# EAGLE design MC-test (EAGLE 8.6.0)
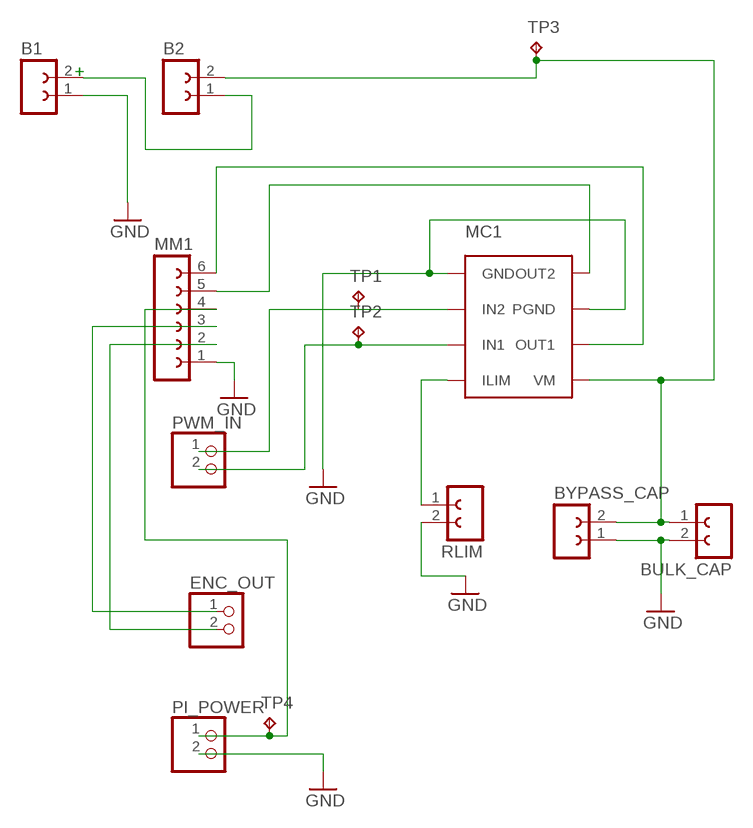
[diagram p0: schematic, sheet 1]

## Parts
B1  FH_02X01  [FH_02X01]
B2  FH_02X01  [FH_02X01]
BULK_CAP  FH_02X01  [FH_02X01]
BYPASS_CAP  FH_02X01  [FH_02X01]
ENC_OUT  PINHD-1X2  [1X02]
MC1  DRV8871  [SO-8_POWERPAD]
MM1  FE06-1  [FE06]
PI_POWER  PINHD-1X2  [1X02]
PWM_IN  PINHD-1X2  [1X02]
RLIM  FH_02X01  [FH_02X01]
TP1  TPTP15SQ  [TP15SQ]
TP2  TPTP15SQ  [TP15SQ]
TP3  TPTP15SQ  [TP15SQ]
TP4  TPTP15SQ  [TP15SQ]

## Nets
3.3V: MM1.4 PI_POWER.1 TP4.TP
GND: B1.1 BULK_CAP.2 BYPASS_CAP.1 MC1.1(GND) MC1.7(PGND) MM1.1 PI_POWER.2 RLIM.2
M+: MC1.8(OUT2) MM1.5
N$1: ENC_OUT.1 MM1.3
N$3: MC1.6(OUT1) MM1.6
N$4: B1.2 B2.1
N$5: B2.2 BULK_CAP.1 BYPASS_CAP.2 MC1.5(VM) TP3.TP
N$6: MC1.4(ILIM) RLIM.1
N$7: ENC_OUT.2 MM1.2
N$8: MC1.3(IN1) PWM_IN.2 TP2.TP
N$9: MC1.2(IN2) PWM_IN.1 TP1.TP

## Notes on the sheet
- +

## Library data of the parts
B1 B2 BULK_CAP BYPASS_CAP = Parts:FH_02X01: Female Header: 2 pins, 1 row, not angled. Identical to con-lsta (but in different sizes).
ENC_OUT PI_POWER PWM_IN = pinhead:PINHD-1X2: PIN HEADER
MC1 = Parts:DRV8871
MM1 = con-lsta:FE06-1: FEMALE HEADER; OC_FARNELL: unknown; OC_NEWARK: unknown
RLIM = Parts:FH_02X01: Female Header: 2 pins, 1 row, not angled. Identical to con-lsta (but in different sizes).; SPICEPREFIX: B
TP1-TP4 = testpad:TP: Test pad

## Board
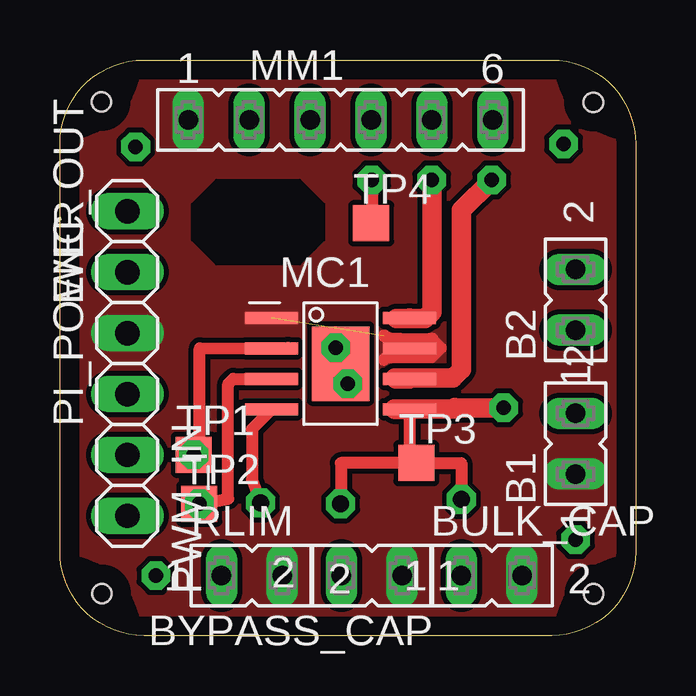
[diagram p1: board, top side]
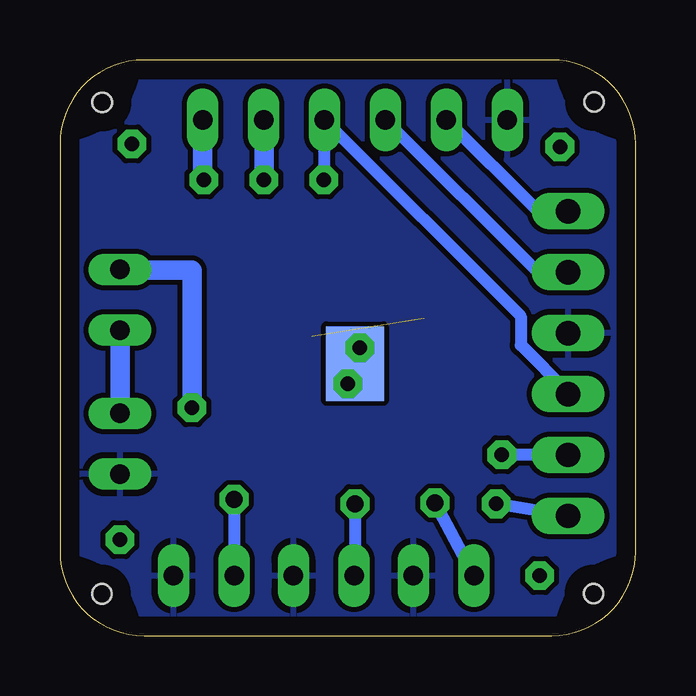
[diagram p2: board, bottom side, seen from below]

Size 24 x 24 mm. Coordinates in mm from the lower left corner, seen from the top.
Outline: 24,20.5 24,3.5 arc-90 20.5,0 3.5,0 arc-90 0,3.5 0,20.5 arc-90 3.5,24 20.5,24 arc-90 24,20.5
Copper layers (1*16): Top 0.035mm / dielectric 1.5mm / Bottom 0.035mm
Design rules "default *": minimum track width 10mil, minimum drill 0.35mm, track to track 8mil, track to pad 8mil, pad to pad 8mil, via to via 8mil, smd to smd 8mil, copper to edge 0.8mm, drill to drill 1mm, minimum pad ring 10mil, minimum via ring 8mil, stop-mask expansion 4mil, vias tented up to drill 0mil, thermal gap 10mil
Holes 0.8 mm at 1.73,22.25 22.24,22.24 22.25,1.74 1.75,1.76

### Footprints (pad centres in the part's own frame; a part is rotated, then mirrored left to right if it is on the bottom)
FH_02X01 = drill 0.813 long: 1 -1.27,0; 2 1.27,0
1X02 = drill 1.016 long: 1 -1.27,0; 2 1.27,0
SO-8_POWERPAD = smd 0.5 x 2.2: 1 -1.905,-2.875; 2 -0.635,-2.875; 3 0.635,-2.875; 4 1.905,-2.875; 5 1.905,2.875; 6 0.635,2.875; 7 -0.635,2.875; 8 -1.905,2.875 | smd 3.1 x 2.4 bottom: POWERPAD_BOTTOM 0,0 | smd 3.1 x 2.4: POWERPAD_TOP 0,0
FE06 = drill 0.813 long: 1 -6.35,0; 2 -3.81,0; 3 -1.27,0; 4 1.27,0; 5 3.81,0; 6 6.35,0
TP15SQ = smd 1.5 x 1.5: TP 0,0

### Placement (x,y rotation side)
B1  21.5,8 90 top
B2  21.5,14 90 top
BULK_CAP  18,2.5 0 top
BYPASS_CAP  13,2.5 180 top
ENC_OUT  2.81,16.42 90 top
MC1  11.7,11.34 270 top
MM1  11.7,21.5 0 top
PI_POWER  2.81,11.34 90 top
PWM_IN  2.81,6.26 270 top
RLIM  8,2.5 0 top
TP1  5.58,7.54 0 top
TP2  5.81,5.5 0 top
TP3  14.86,7.19 0 top
TP4  12.97,17.19 0 top

### Tracks (layer width: path | path; a pad name or v marks a point on that pad's centre or on a via)
3.3V  (via drill 0.6 pad 1.2)
  Top 0.508: v13,19 13,17.22 TP4.TP
  Bottom 0.508: v13,19 13,21.47 MM1.4 4.79,13.32 4.79,12.11 2.81,10.12 PI_POWER.1
GND  (1 unrouted)
  Top 0.508: 14.19,12.37 MC1.7 14.78,11.78 13.78,11.78 13.61,11.61 | 14.19,12.37 13.67,12.37 13.54,12.5 13.5,12.5 | 14.19,12.37 15.52,12.37 15.88,12 15.88,11.99 15.5,11.61 13.61,11.61 | 13.5,11.5 13.61,11.61
  pour Top (rank 6, no thermals, hatched): 3.5,24 arc-90 0,20.5 0,3.5 arc-90 3.5,0 20.5,0 arc-90 24,3.5 24,20.5 arc-90 20.5,24
  pour Bottom: 3.5,24 arc-90 0,20.5 0,3.5 arc-90 3.5,0 20.5,0 arc-90 24,3.5 24,20.5 arc-90 20.5,24
M+  (via drill 0.6 pad 1.2)
  Top 0.813: v15.5,19 15.5,13.5 15.23,13.23 14.56,13.23 | 14.03,13.23 14.56,13.23 | 14.56,13.23 MC1.8
  Bottom 0.813: MM1.5 v15.5,19
N$1
  Bottom 0.508: ENC_OUT.1 4.08,15.15 MM1.3
N$2  (via drill 0.6 pad 1.2)
  other vias: 3.15,20.38
N$3  (via drill 0.6 pad 1.2)
  Top 0.813: v18,19 16.75,17.75 16.75,11.1 16.39,10.74 13.97,10.74 14.01,10.71 MC1.6
  Bottom 0.813: MM1.6 18.05,19.05 v18,19
N$4
  Bottom 0.813: B2.1 B1.2
N$5  (via drill 0.6 pad 1.2, 0.7 pad 1.2)
  Top 0.508: MC1.5 14.57,7.47 TP3.TP | TP3.TP 11.72,7.19 11.72,5.49 v11.7,5.49 | TP3.TP 16.74,7.19 v16.74,5.68
  Top 0.813: MC1.5 13.96,9.44 13.95,9.44 16.4,9.44 16.46,9.5 16.47,9.5 v18.5,9.5
  Bottom 0.508: v11.7,5.49 11.7,2.5 BYPASS_CAP.2 | v16.74,5.68 BULK_CAP.1
  Bottom 0.813: v18.5,9.5 18.5,15.22 18.52,15.23 21.46,15.23 B2.2
N$6  (via drill 0.7 pad 1.2)
  Top 0.508: MC1.4 8,8.61 8,6.5 v8.36,5.53
  Bottom 0.508: v8.36,5.53 RLIM.1
N$7
  Bottom 0.508: ENC_OUT.2 4.08,17.69 MM1.2
N$8  (via drill 0.6 pad 1.2)
  Top 0.508: TP2.TP 7.02,5.7 7.02,10.5 7.22,10.71 MC1.3
  Bottom 0.508: PWM_IN.2 TP2.TP
  other vias: 5.81,5.5
N$9  (via drill 0.6 pad 1.2)
  Top 0.508: 5.83,7.94 5.83,11.98 9.5,12 9.47,11.97 MC1.2
  Top 0.813: TP1.TP 5.83,7.94
  Bottom 0.508: PWM_IN.1 5.57,7.53
  Bottom 0.813: 5.57,7.53 TP1.TP
  other vias: 5.58,7.54
N$10  (via drill 0.6 pad 1.2)
  other vias: 11.5,12
N$11  (via drill 0.6 pad 1.2)
  other vias: 12,10.5
N$12  (via drill 0.6 pad 1.2)
  other vias: 21.5,4
N$13  (via drill 0.6 pad 1.2)
  other vias: 21,20.5
N$14  (via drill 0.6 pad 1.2)
  other vias: 4,2.5
N$15
  cutout Top: 5.5,18 6.5,19 10,19 11,18 11,16.5 10,15.5 6.5,15.5 5.5,16.5